# Altium schematic sheet E16-PDB-2-PROCESSOR.SchDoc
size A4
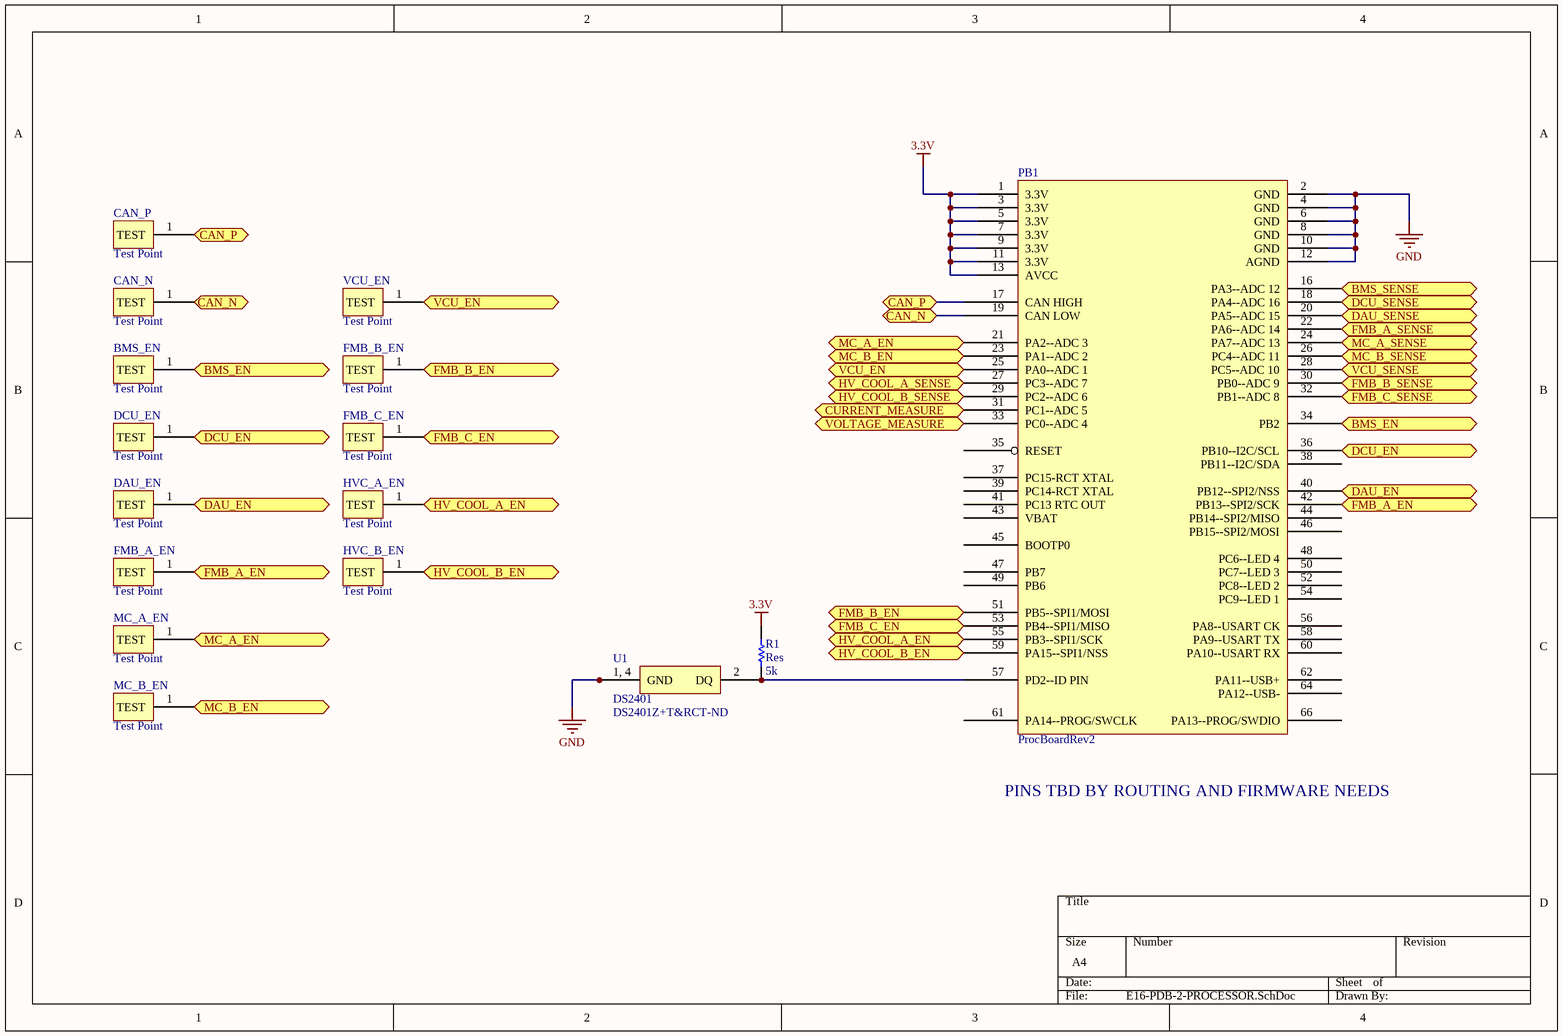
[diagram p0: E16-PDB-2-PROCESSOR.SchDoc]

## Parts
BMS_EN  Test Point  [TEST POINT 5000K]
CAN_N  Test Point  [TEST POINT 5000K]
CAN_P  Test Point  [TEST POINT 5000K]
DAU_EN  Test Point  [TEST POINT 5000K]
DCU_EN  Test Point  [TEST POINT 5000K]
FMB_A_EN  Test Point  [TEST POINT 5000K]
FMB_B_EN  Test Point  [TEST POINT 5000K]
FMB_C_EN  Test Point  [TEST POINT 5000K]
HVC_A_EN  Test Point  [TEST POINT 5000K]
HVC_B_EN  Test Point  [TEST POINT 5000K]
MC_A_EN  Test Point  [TEST POINT 5000K]
MC_B_EN  Test Point  [TEST POINT 5000K]
PB1  ProcBoardRev2  [PROC_BOARD]
R1  Res  value 5k  [2012[0805]]
U1  DS2401  Supplier Part Number 1: DS2401Z+T&RCT-ND  [SOT-223-3L]
VCU_EN  Test Point  [TEST POINT 5000K]

## Ports
BMS_EN, BMS_SENSE, CAN_N, CAN_P, CURRENT_MEASURE, DAU_EN, DAU_SENSE, DCU_EN, DCU_SENSE, FMB_A_EN, FMB_A_SENSE, FMB_B_EN, FMB_B_SENSE, FMB_C_EN, FMB_C_SENSE, HV_COOL_A_EN, HV_COOL_A_SENSE, HV_COOL_B_EN, HV_COOL_B_SENSE, MC_A_EN, MC_A_SENSE, MC_B_EN, MC_B_SENSE, VCU_EN, VCU_SENSE, VOLTAGE_MEASURE

## Nets
3.3V: PB1.1(3.3V) PB1.3(3.3V) PB1.5(3.3V) PB1.7(3.3V) PB1.9(3.3V) PB1.11(3.3V) PB1.13(AVCC) R1.2
GND: PB1.2(GND) PB1.4(GND) PB1.6(GND) PB1.8(GND) PB1.10(GND) PB1.12(AGND) U1.1(GND) U1.4(GND)
BMS_EN: BMS_EN.1(TEST) PB1.34(PB2) ; port BMS_EN
BMS_SENSE: PB1.16(PA3--ADC_12) ; port BMS_SENSE
CAN_N: CAN_N.1(TEST) PB1.19(CAN_LOW) ; port CAN_N
CAN_P: CAN_P.1(TEST) PB1.17(CAN_HIGH) ; port CAN_P
CURRENT_MEASURE: PB1.31(PC1--ADC_5) ; port CURRENT_MEASURE
DAU_EN: DAU_EN.1(TEST) PB1.40(PB12--SPI2/NSS) ; port DAU_EN
DAU_SENSE: PB1.20(PA5--ADC_15) ; port DAU_SENSE
DCU_EN: DCU_EN.1(TEST) PB1.36(PB10--I2C/SCL) ; port DCU_EN
DCU_SENSE: PB1.18(PA4--ADC_16) ; port DCU_SENSE
FMB_A_EN: FMB_A_EN.1(TEST) PB1.42(PB13--SPI2/SCK) ; port FMB_A_EN
FMB_A_SENSE: PB1.22(PA6--ADC_14) ; port FMB_A_SENSE
FMB_B_EN: FMB_B_EN.1(TEST) PB1.51(PB5--SPI1/MOSI) ; port FMB_B_EN
FMB_B_SENSE: PB1.30(PB0--ADC_9) ; port FMB_B_SENSE
FMB_C_EN: FMB_C_EN.1(TEST) PB1.53(PB4--SPI1/MISO) ; port FMB_C_EN
FMB_C_SENSE: PB1.32(PB1--ADC_8) ; port FMB_C_SENSE
HV_COOL_A_EN: HVC_A_EN.1(TEST) PB1.55(PB3--SPI1/SCK) ; port HV_COOL_A_EN
HV_COOL_A_SENSE: PB1.27(PC3--ADC_7) ; port HV_COOL_A_SENSE
HV_COOL_B_EN: HVC_B_EN.1(TEST) PB1.59(PA15--SPI1/NSS) ; port HV_COOL_B_EN
HV_COOL_B_SENSE: PB1.29(PC2--ADC_6) ; port HV_COOL_B_SENSE
MC_A_EN: MC_A_EN.1(TEST) PB1.21(PA2--ADC_3) ; port MC_A_EN
MC_A_SENSE: PB1.24(PA7--ADC_13) ; port MC_A_SENSE
MC_B_EN: MC_B_EN.1(TEST) PB1.23(PA1--ADC_2) ; port MC_B_EN
MC_B_SENSE: PB1.26(PC4--ADC_11) ; port MC_B_SENSE
VCU_EN: PB1.25(PA0--ADC_1) VCU_EN.1(TEST) ; port VCU_EN
VCU_SENSE: PB1.28(PC5--ADC_10) ; port VCU_SENSE
VOLTAGE_MEASURE: PB1.33(PC0--ADC_4) ; port VOLTAGE_MEASURE
NetPB1_57: PB1.57(PD2--ID_PIN) R1.1 U1.2(DQ)

Not connected (* = marked no-connect by the designer): PB1 14(NC) 15(NC) 35(RESET) 37(PC15-RCT_XTAL) 38(PB11--I2C/SDA) 39(PC14-RCT_XTAL) 41(PC13_RTC_OUT) 43(VBAT) 44(PB14--SPI2/MISO) 45(BOOTP0) 46(PB15--SPI2/MOSI) 47(PB7) 48(PC6--LED_4) 49(PB6) 50(PC7--LED_3) 52(PC8--LED_2) 54(PC9--LED_1) 56(PA8--USART_CK) 58(PA9--USART_TX) 60(PA10--USART_RX) 61(PA14--PROG/SWCLK) 62(PA11--USB+) 63(NC) 64(PA12--USB-) 65(NC) 66(PA13--PROG/SWDIO) 67

## Notes on the sheet
- PINS TBD BY ROUTING AND FIRMWARE NEEDS
- (in symbol DS2401) 1, 4

## Library data of the parts
BMS_EN CAN_N CAN_P DAU_EN DCU_EN FMB_A_EN FMB_B_EN FMB_C_EN HVC_A_EN HVC_B_EN MC_A_EN MC_B_EN VCU_EN = Test Point: 5000-5004, 5015-5019 Keystone Electronics
PB1 = ProcBoardRev2: Processor board that carries the STM32F072RB
R1 = Res: Surface Mount Resistor; Published: 8-Jun-2000; LatestRevisionDate: 17-Jul-2002; LatestRevisionNote: Re-released for DXP Platform.; PackageReference: AXIAL-0.5; Publisher: Altium Limited
U1 = DS2401: IC SILICON SERIAL NUMBER SOT223; Supplier 1: Digi-Key